# EasyEDA schematic SCH_GPS_lora_mpu_uv_bmp__2022-12-29.json
TITLE: final ckt diagram; REV: 1.0; Date: 2022-12-29; Sheet: 1/1; Drawn By: Saiman Pokhrel; Company: bic hackathon
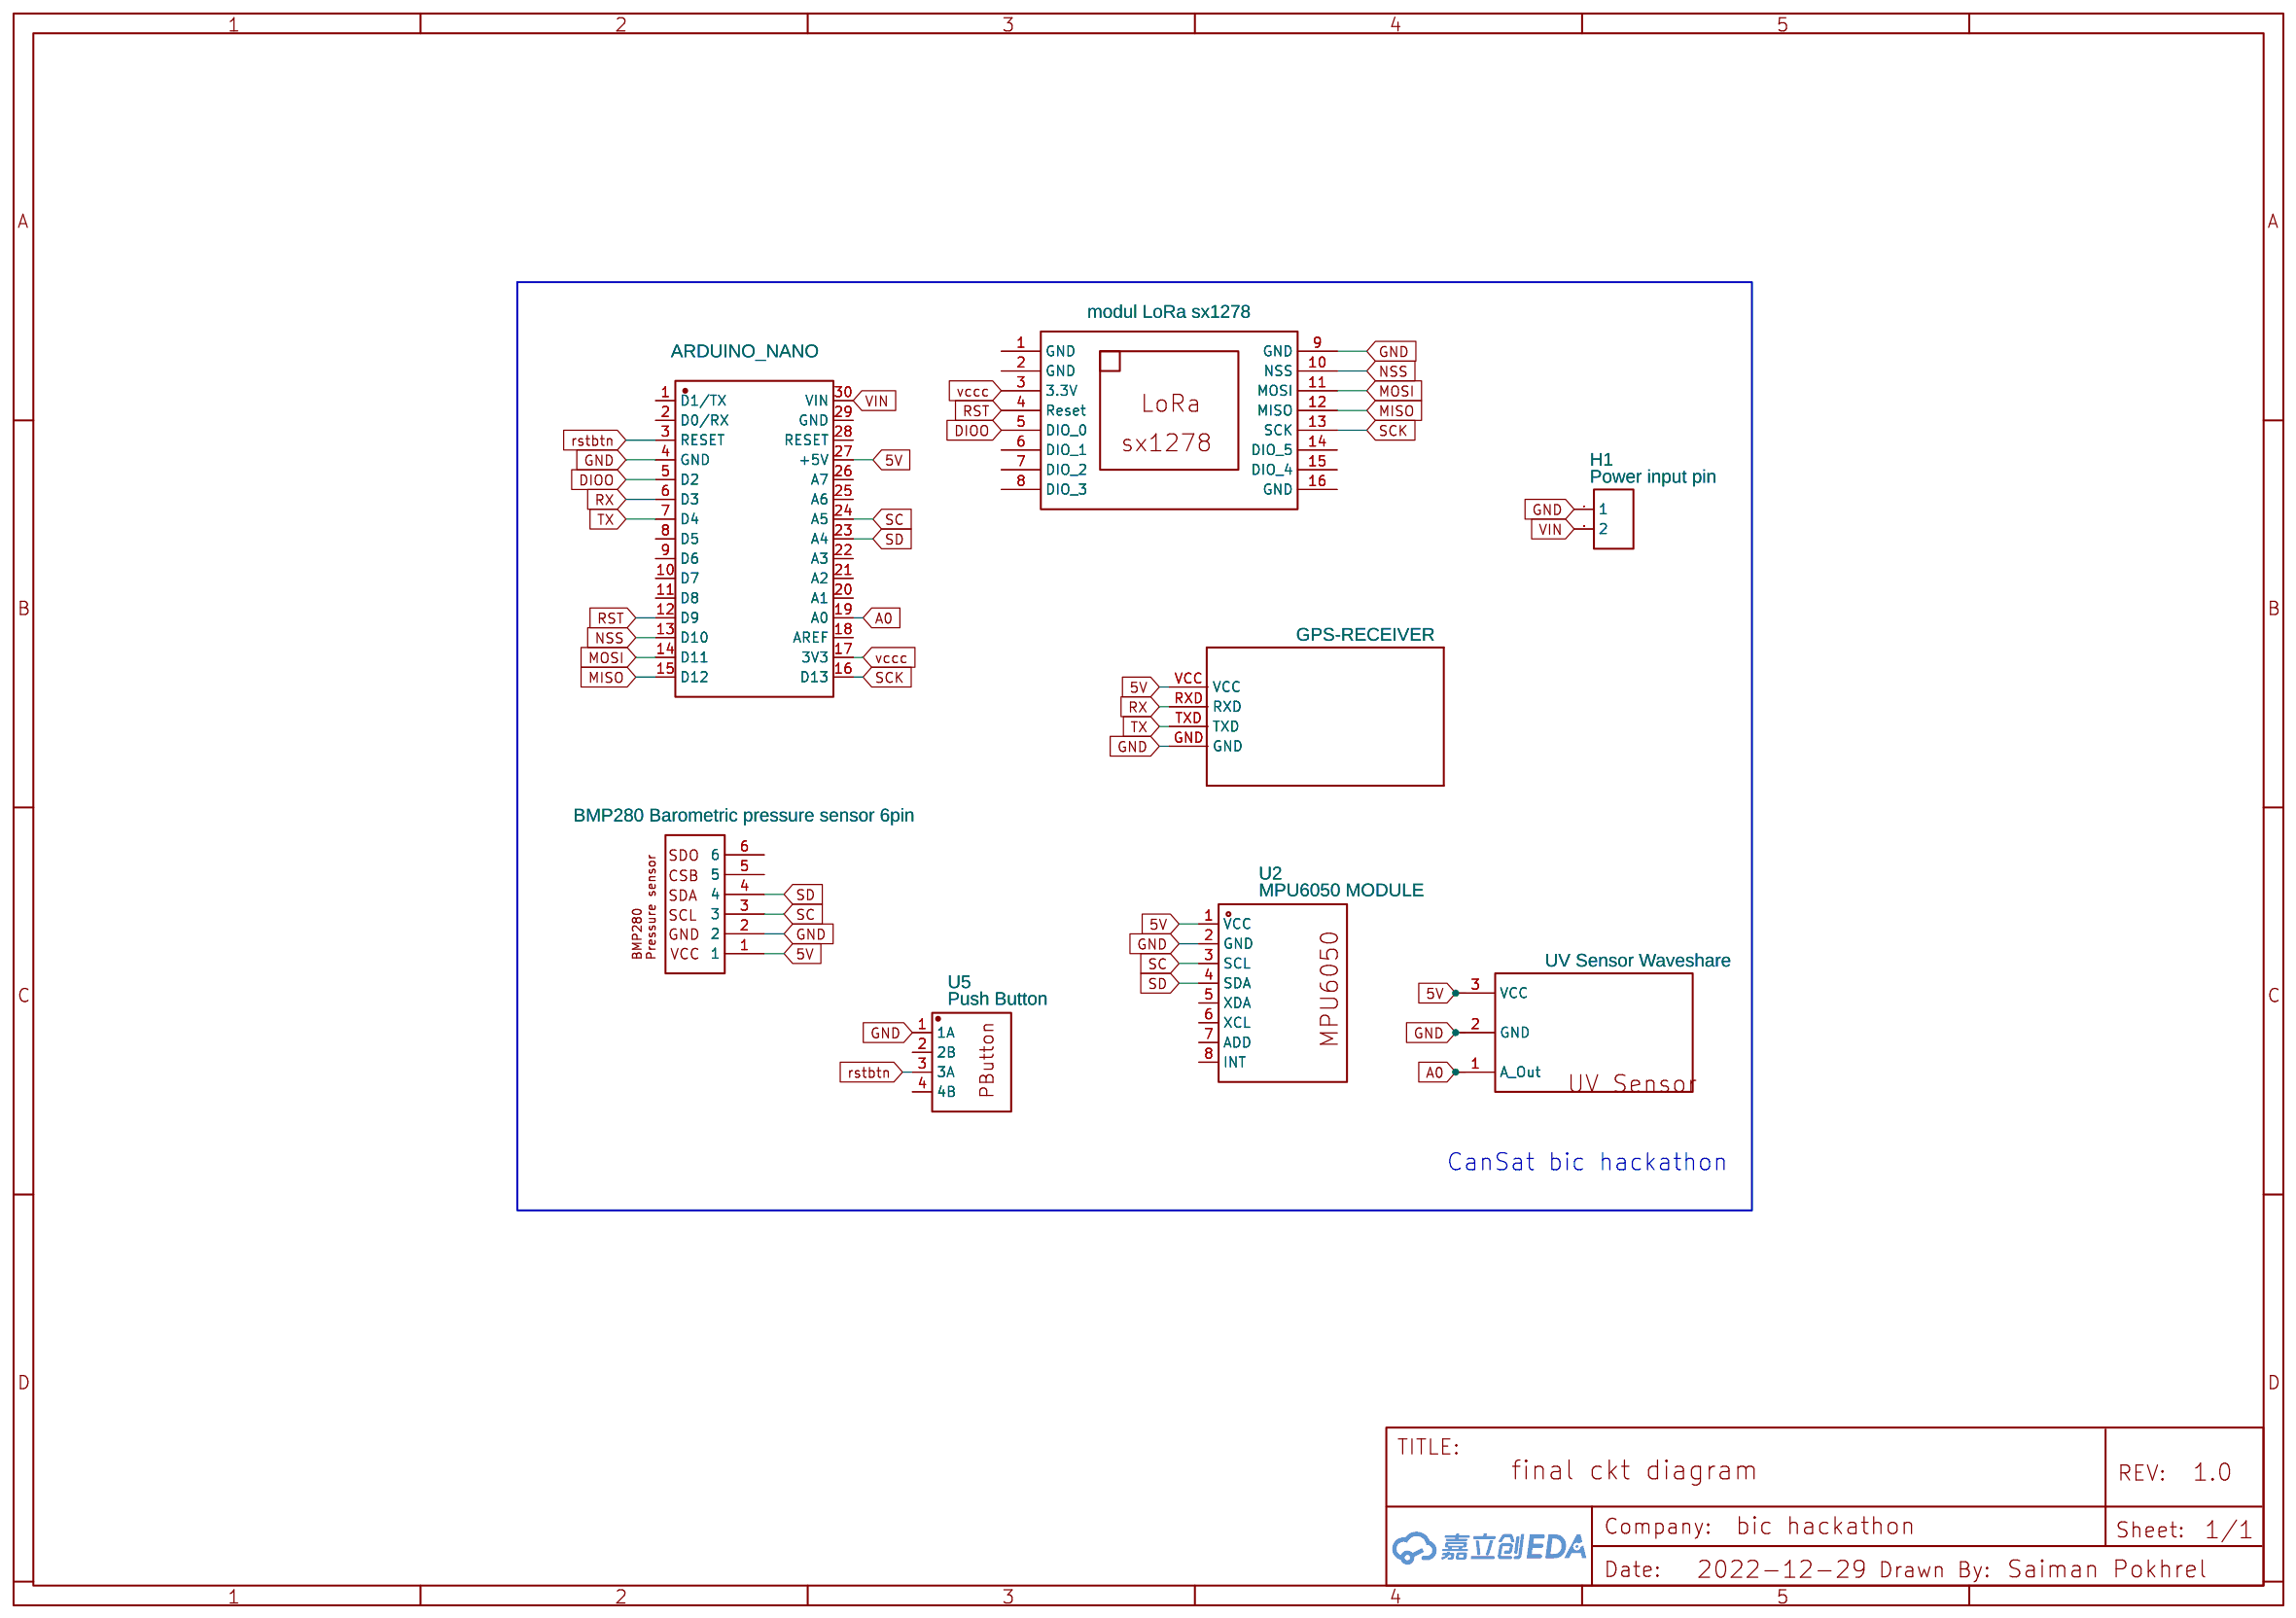
[diagram p0: schematic sheet]

## Parts
1  GPS-RECEIVER  [GPS-RECEIVER-NEO8M]
AOUT1  UV Sensor Waveshare  [3_PINOS]
H1  Power input pin  [HDR-F-2.54_1X2]
U1  BMP280 Barometric pressure sensor 6pin  [BMP280]
U2  MPU6050 MODULE  [MPU6050]
U3  modul LoRa sx1278  [MODUL LORA SX1278]
U4  ARDUINO_NANO  [COMM-TH_ARDUINO_NANO]
U5  Push Button  [PUSHBUTTON]

## Library data of the parts
1 = GPS-RECEIVER-NEO8M: Contributor: plainolddave
AOUT1 = UV Sensor Waveshare: Manufacturer: Waveshare; Manufacturer Part: SKU: 9537; Supplier: Waveshare; Supplier Part: UV Sensor; link: https://www.waveshare.com/product/modules/sensors/light-ranging/uv-sensor.htm; Contributor: lufer2000
H1 = HDR-F-2.54_1x2: Supplier Part: C49661; Supplier: LCSC; Contributor: LCEDA_Lib
U1 = BMP280 Barometric pressure sensor 6pin: Manufacturer Part: MAX6675; Contributor: RealJanis
U2 = MPU6050 MODULE: Supplier: Aliexpress; Contributor: Frey_Hertz
U3 = modul LoRa sx1278: Contributor: abangilham98
U4 = ARDUINO_NANO: Supplier: LCSC; Supplier Part: C9900017879; Manufacturer: null; JLCPCB Part Class: Extended Part; Contributor: lcsc
U5 = Push Button

## Nets
5V: 1.VCC AOUT1.3(VCC) U1.1 U2.1(VCC) U4.27(+5V)
GND: 1.GND AOUT1.2(GND) H1.1 U1.2 U2.2(GND) U3.9(GND) U4.4(GND) U5.1(1A)
vccc: U3.3(3.3V) U4.17(3V3)
VIN: H1.2 U4.30(VIN)
A0: AOUT1.1(A Out) U4.19(A0)
DIOO: U3.5(DIO 0) U4.5(D2)
MISO: U3.12(MISO) U4.15(D12)
MOSI: U3.11(MOSI) U4.14(D11)
NSS: U3.10(NSS) U4.13(D10)
RST: U3.4(Reset) U4.12(D9)
rstbtn: U4.3(RESET) U5.3(3A)
RX: 1.RXD U4.6(D3)
SC: U1.3 U2.3(SCL) U4.24(A5)
SCK: U3.13(SCK) U4.16(D13)
SD: U1.4 U2.4(SDA) U4.23(A4)
TX: 1.TXD U4.7(D4)

Not connected (* = marked no-connect by the designer): U1 5 6; U2 5(XDA) 6(XCL) 7(ADD) 8(INT); U3 1(GND) 2(GND) 6(DIO 1) 7(DIO 2) 8(DIO 3) 14(DIO 5) 15(DIO 4) 16(GND); U4 1(D1/TX) 2(D0/RX) 8(D5) 9(D6) 10(D7) 11(D8) 18(AREF) 20(A1) 21(A2) 22(A3) 25(A6) 26(A7) 28(RESET) 29(GND); U5 2(2B) 4(4B)

## Notes on the sheet
- CanSat bic hackathon
